# Altium schematic sheet Power Management.SchDoc: Power Management
size A4; DrawnBy: Benjamin Williams; Address1: ECE Department; Address2: University of Canterbury; Address3: Christchurch 8041; Address4: New Zealand; Revision: 1; SheetNumber: 2; SheetTotal: 3
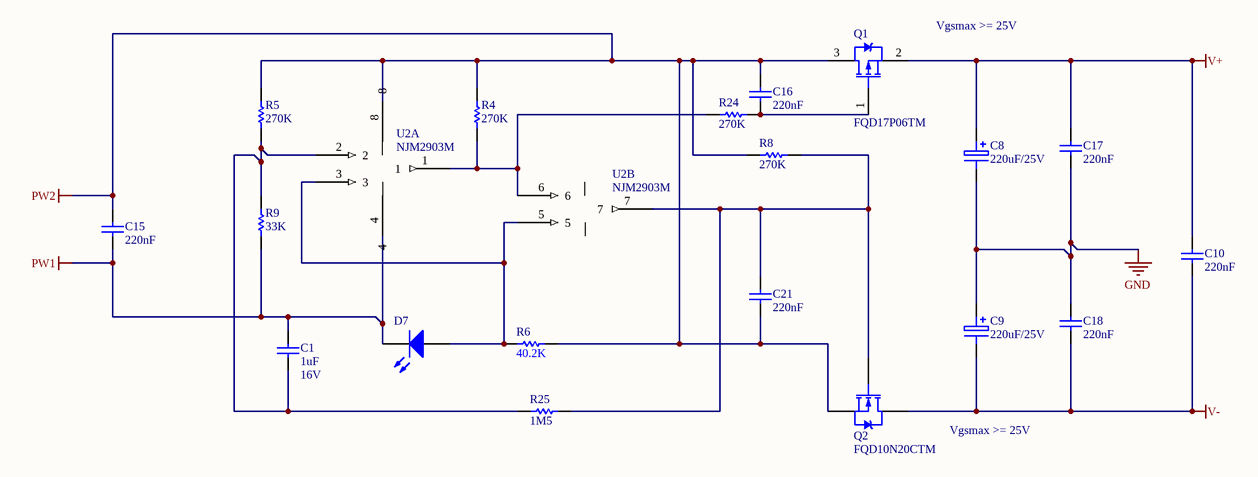
[diagram p0: Power Management.SchDoc]

## Parts
C1  Max Voltage: 16V  [CAPC1608L]  (hidden comment: 1uF)
C8  220uF/25V  [UUQ1E221MCL1GS]
C9  220uF/25V  [UUQ1E221MCL1GS]
C10  220nF  [CAPC1608L]
C15  220nF  [CAPC1608L]
C16  220nF  [CAPC1608L]
C17  220nF  [CAPC1608L]
C18  220nF  [CAPC1608L]
C21  220nF  [CAPC1608L]
D7  H-E RED  [MV5764.MP4B]  (value not drawn)
Q1  FQD17P06TM  [FQD17P06TM]
Q2  FQD10N20CTM  [FQD10N20CTM]
R4  270K  [RESC1608L]
R5  270K  [RESC1608L]
R6  40.2K  [RESC1608L]
R8  270K  [RESC1608L]
R9  33K  [RESC1608L]
R24  270K  [RESC1608L]
R25  1M5  [RESC1608L]
U2  NJM2903M  [NJM2903M]  (parts A,B of 2)

## Nets
GND: C8.1 C9.2 C17.1 C18.2
PW1: C1.2 C15.1 D7.1(K) R9.1
PW2: C15.2 C16.2 C21.1 Q1.3 Q2.3(S) R4.2 R5.2 R6.2 R8.1
V+: C8.2 C10.2 C17.2 Q1.2
V-: C9.1 C10.1 C18.1 Q2.2(D)
NetC1_1: C1.1 R5.1 R9.2 R25.1 U2.2
NetC16_1: C16.1 Q1.1 R24.2
NetC21_2: C21.2 Q2.1(G) R8.2 R25.2 U2.7
NetD7_2: D7.2(A) R6.1 U2.3 U2.5
NetR4_1: R4.1 R24.1 U2.1 U2.6

Not connected (* = marked no-connect by the designer): U2 4 8

## Notes on the sheet
- Vgsmax >= 25V
- Title
- Drawn by:
- Date:
- Time:
- Revision:
- Sheet
- of
- File:

## Library data of the parts
C1 = CC_1uF_0603: CAP CER 1uF Y5V -20% +80% 16V 0603; PackageReference: 0603; Code_IPC: 1608 [0603]; Verify: *; Supplier: ECE Dept; Storage Location: PCB Assembly WS; Value: 1uF
C8 C9 = CA_100uF_16V: 220µF 25V Aluminum Capacitors Radial, Can - SMD 1000 Hrs @ 105°C; Manufacturer PN: UWX1C101MCL1GB; Manufacturer: Nichcon; Supplier 1: Digi-Key; Supplier Part Number 1: 493-3204-1-ND; Storage Location: PCB Assembly WS; Supplier: ECE Dept; Supplier 2: Digi-Key; Supplier Part Number 2: 493-2105-1-ND; Value: 220uF/25V
C10 C15-C18 C21 = CC_220nF_0603: CAP CER 220nF Y5V -20% +80% 25V 0603; PackageReference: 0603; Code_IPC: 1608 [0603]; Verify: *; Supplier: ECE Dept; Storage Location: PCB Assembly WS; MoV: 25V; Value: 220nF
D7 = DL_150060BS75000: LED Blue 270mcd 0603 SMD; Manufacturer: WURTH ELEKTRONIK; Forward Current If: 30; Forward Voltage: 3.2; Luminous Intensity: 270; Viewing Angle: 120°; Wavelength Typ: 470; Pricing: 1=0.3844, 50=0.3252, 100=0.2957, 500=0.2365 (NZD); Supplier 1: Farnell; Supplier Part Number 1: 2322069; Manufacturer Part Number: MV5764.MP4B; Storage Location: PCB Assembly WS; Supplier: ECE Dept; LED Colour: H-E RED
Q1 = TM_SSM3J328R: P-Channel 60V 12A (Tc) 2.5W (Ta), 44W (Tc) Surface Mount D-Pak; FET Feature: Logic Level Gate, 1.5V Drive; FET Type: MOSFET P-Channel, Metal Oxide; Gate Charge (Qg) @ Vgs: 27nC @ 10V; Input Capacitance (Ciss) @ Vds: 900pF @ 25V; Vgs(th) (Max) @ Id: 4V @ 250µA; Current - Continuous Drain (Id) @ 25° C: 12A (Tc); Drain to Source Voltage (Vdss): 60V; Package / Case: SOT-23-3 Flat Leads; Power - Max: 2.5W (Ta), 44W (Tc); Supplier Device Package: SOT-23F; Pricing: 1=0.79, 10=0.658, 25=0.5772, 100=0.4939, 250=0.42836, 500=0.36284, 1000=0.27972 (NZD); Supplier 1: Digi-Key; Supplier Part Number 1: SSM3J328RLF(ACT-ND; Supplier 2: Mouser; Supplier Part Number 2: N/A; Supplier Part Number: SSM3J328RLF(ACT-ND; Storage Location: PCB Assembly WS; Supplier: ECE Dept; Manufacturer Part Number: FQD17P06TM
Q2 = NMOS-2: N-Channel Power MOSFET; Note: Pin 2 is electrically connected to pin 4.; Published: 8-Jun-2000; LatestRevisionDate: 17-Jul-2002; LatestRevisionNote: Re-released for DXP Platform.; DatasheetVersion: PD-9.814; PackageVersion: Feb-1997; PackageReference: D-Pak; Publisher: Altium Limited; PackageDescription: TO-252-3, DPak (2 Leads + Tab), SC-63; ComponentLink1Description: Manufacturer Link; ComponentLink1URL: http://www.irf.com/
R4 R5 R8 R24 = RS_270K: RES 270K OHM 1/10W 5% 0603 SMD; Storage Location: PCB Assembly WS; Supplier: ECE Dept; Value: 270K
R6 = RS_43K: RES 43K OHM 1/10W 5% 0603 SMD; Storage Location: PCB Assembly WS; Supplier: ECE Dept; Value: 40.2K
R9 = RS_33K: RES 33.0K OHM 1/10W 5% 0603 SMD; Storage Location: PCB Assembly WS; Supplier: ECE Dept; Value: 33K
R25 = RS_1M5: RES 1.5M OHM 1/10W 5% 0603 SMD; Supplier: ECE Dept; Storage Location: PCB Assembly WS; Value: 1M5
U2 = NJM2903D